# EAGLE design ArduFrauenfelderCNC (EAGLE 5.11)
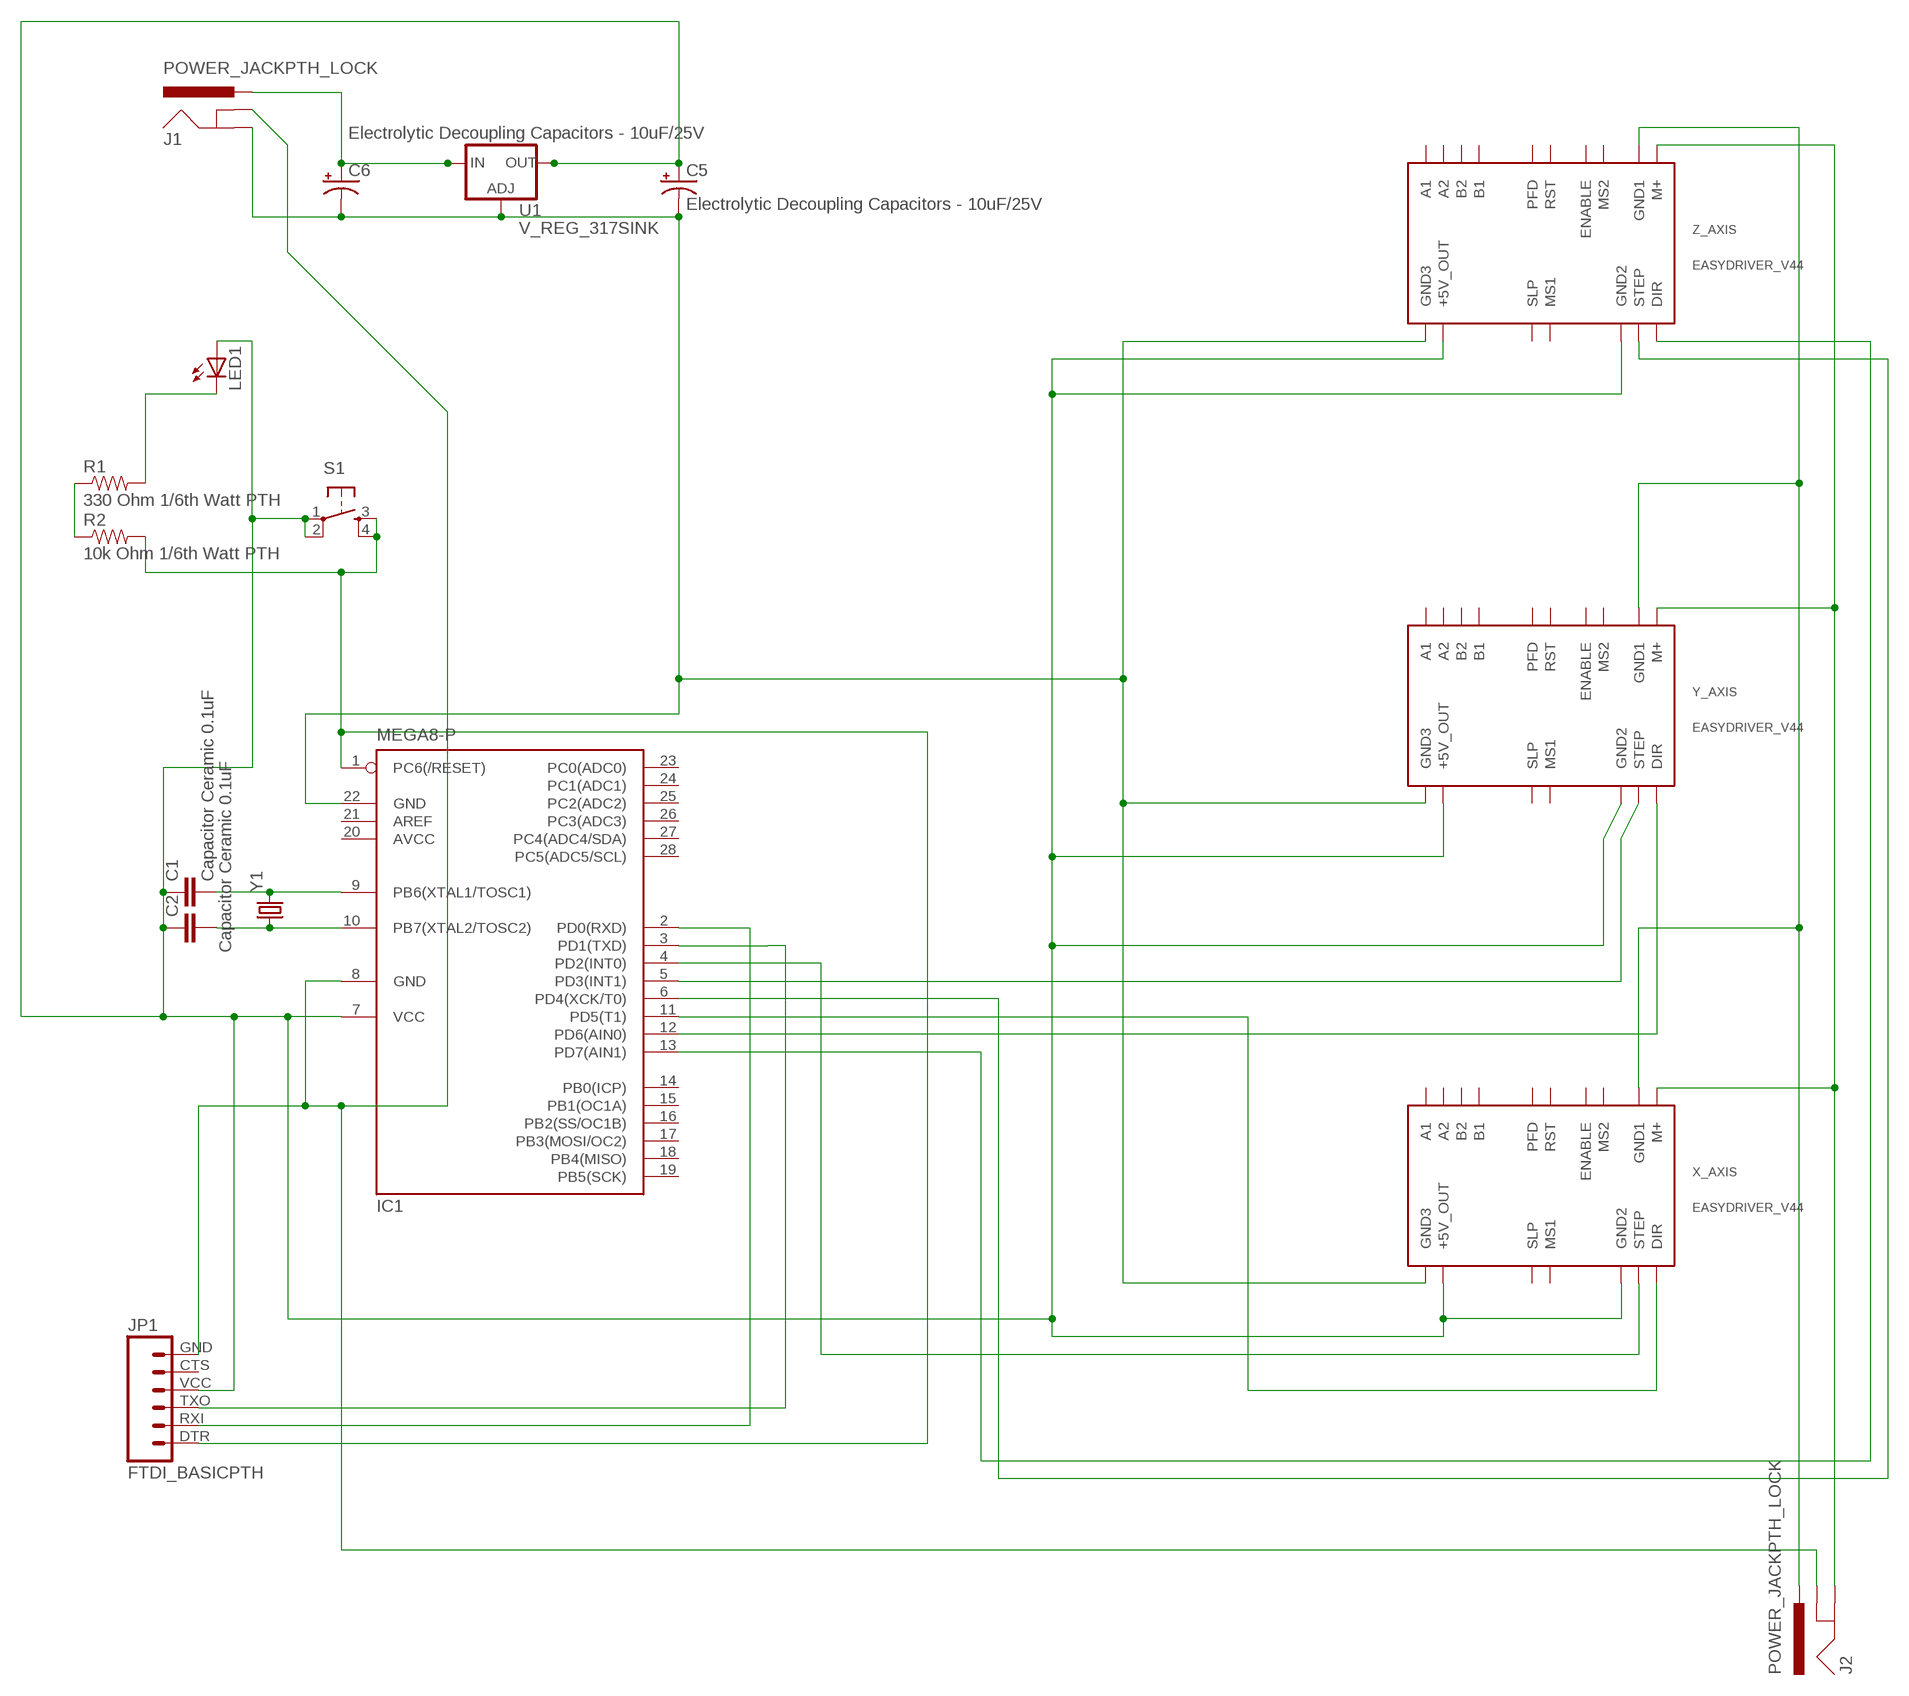
[diagram p0: schematic, sheet 1]

## Parts
C1  Capacitor Ceramic 0.1uF  CAPPTH  [CAP-PTH-SMALL]
C2  Capacitor Ceramic 0.1uF  CAPPTH  [CAP-PTH-SMALL]
C5  Electrolytic Decoupling Capacitors - 10uF/25V  CAP_POLPTH2  [CPOL-RADIAL-10UF-25V]
C6  Electrolytic Decoupling Capacitors - 10uF/25V  CAP_POLPTH2  [CPOL-RADIAL-10UF-25V]
IC1  MEGA8-P  [DIL28-3]
J1  POWER_JACKPTH_LOCK  [POWER_JACK_PTH_LOCK]
J2  POWER_JACKPTH_LOCK  [POWER_JACK_PTH_LOCK]
JP1  FTDI_BASICPTH  [FTDI_BASIC]
LED1  LED5MM  [LED5MM]
R1  330 Ohm 1/6th Watt PTH  RESISTORPTH-1/4W  [AXIAL-0.4]
R2  10k Ohm 1/6th Watt PTH  RESISTORPTH-1/4W  [AXIAL-0.4]
S1  TAC_SWITCHPTH  [TACTILE-PTH]
U1  V_REG_317SINK  [TO220-ADJ]
X_AXIS  EASYDRIVER_V44  [EASYDRIVER_V44]
Y1  CRYSTALHC49US  [HC49US]
Y_AXIS  EASYDRIVER_V44  [EASYDRIVER_V44]
Z_AXIS  EASYDRIVER_V44  [EASYDRIVER_V44]

## Nets
N$1: C1.2 IC1.9(PB6(XTAL1/TOSC1)) Y1.2
N$2: C2.2 IC1.10(PB7(XTAL2/TOSC2)) Y1.1
N$3: IC1.5(PD3(INT1)) Y_AXIS.STEP
N$4: LED1.K(C) R1.P$2
N$5: IC1.1(PC6(/RESET)) JP1.DTR R2.P$2 S1.3 S1.4
N$6: R1.P$1 R2.P$1
N$7: C6.1(+) J1.PWR U1.IN
N$8: C5.2(-) C6.2(-) IC1.22(GND) J1.GND U1.ADJ X_AXIS.GND3 Y_AXIS.GND3 Z_AXIS.GND3
N$9: C1.1 C2.1 C5.1(+) IC1.7(VCC) JP1.VCC LED1.A S1.1 S1.2 U1.OUT X_AXIS.GND2 X_AXIS.P$11(+5V_OUT) Y_AXIS.GND2 Y_AXIS.P$11(+5V_OUT) Z_AXIS.GND2 Z_AXIS.P$11(+5V_OUT)
N$10: IC1.8(GND) J1.GNDBREAK J2.GNDBREAK JP1.GND
N$11: IC1.3(PD1(TXD)) JP1.TXO
N$12: IC1.2(PD0(RXD)) JP1.RXI
N$13: IC1.12(PD6(AIN0)) Y_AXIS.DIR
N$14: IC1.4(PD2(INT0)) X_AXIS.STEP
N$15: J2.PWR X_AXIS.GND1 Y_AXIS.GND1 Z_AXIS.GND1
N$16: IC1.11(PD5(T1)) X_AXIS.DIR
N$18: J2.GND X_AXIS.M+ Y_AXIS.M+ Z_AXIS.M+
N$19: IC1.13(PD7(AIN1)) Z_AXIS.DIR
N$20: IC1.6(PD4(XCK/T0)) Z_AXIS.STEP
Unconnected: IC1.14(PB0(ICP)) IC1.15(PB1(OC1A)) IC1.16(PB2(SS/OC1B)) IC1.17(PB3(MOSI/OC2)) IC1.18(PB4(MISO)) IC1.19(PB5(SCK)) IC1.21(AREF) IC1.23(PC0(ADC0)) IC1.24(PC1(ADC1)) IC1.25(PC2(ADC2)) IC1.26(PC3(ADC3)) IC1.27(PC4(ADC4/SDA)) IC1.28(PC5(ADC5/SCL)) JP1.CTS X_AXIS.A1 X_AXIS.A2 X_AXIS.B1 X_AXIS.B2 X_AXIS.ENABLE X_AXIS.MS1 X_AXIS.MS2 X_AXIS.PFD X_AXIS.RST X_AXIS.SLEEP(SLP) Y_AXIS.A1 Y_AXIS.A2 Y_AXIS.B1 Y_AXIS.B2 Y_AXIS.ENABLE Y_AXIS.MS1 Y_AXIS.MS2 Y_AXIS.PFD Y_AXIS.RST Y_AXIS.SLEEP(SLP) Z_AXIS.A1 Z_AXIS.A2 Z_AXIS.B1 Z_AXIS.B2 Z_AXIS.ENABLE Z_AXIS.MS1 Z_AXIS.MS2 Z_AXIS.PFD Z_AXIS.RST Z_AXIS.SLEEP(SLP)

## Power pins joined to a net without a drawn wire
AVCC: IC1.20(AVCC)

## Library data of the parts
C1 C2 = SparkFun:CAP: Capacitor Standard 0603 ceramic capacitor, and 0.1" leaded capacitor.
C5 C6 = SparkFun:CAP_POL: Capacitor Polarized These are standard SMD and PTH capacitors. Normally 10uF, 47uF, and 100uF in electrolytic and tantalum varieties. Always verify the external diameter of the through hole cap, it varies with capacity, voltage, and manufacturer. The EIA devices should be standard.
IC1 = atmel:MEGA8-P: MICROCONTROLLER 8 Kbytes FLASH, 1 kbytes SRAM, 512 bytes EEPROM, USART, 4-channel 10 bit ADC, 2-channel 8 bit ADC Pin compatible with Atmega48, ATMega88, ATMega168 Source: avr.lbr; OC_FARNELL: unknown; OC_NEWARK: unknown
J1 J2 = SparkFun:POWER_JACK: Power Jack This is the standard 5.5mm barrel jack for power. The PTH is the most common, proven, reliable, footprint. All others are experimental. The Slot footprint only works if the mill layer is transmitted to the PCB fab house so be warned. Spark Fun Electronics SKU : PRT-00119. Mating wall wart : TOL-00298 (and others)
JP1 = SparkFun:FTDI_BASIC: FTDI Basic: 3.3V and 5V
LED1 = SparkFun:LED: LEDs Standard schematic elements and footprints for 5mm, 3mm, 1206, and 0603 sized LEDs. 5mm - Spark Fun Electronics SKU : COM-00529 (and others)
R1 R2 = SparkFun:RESISTOR: Resistor Basic schematic elements and footprints for 0603, 1206, and PTH resistors.
S1 = SparkFun:TAC_SWITCH: Momentary Switch Button commonly used for reset or general input. Spark Fun Electronics SKU : COM-00097
U1 = SparkFun:V_REG_317: Voltage Regulator Standard LM317 adjustable voltage regulator. AOI (Adjust Output Input). Google 'LM317 Calculator' for easy to use app to get the two resistor values needed. 240/720 for 5V output. 240/390 for 3.3V output. Spark Fun Electronics SKU : COM-00527
X_AXIS Y_AXIS Z_AXIS = EasyDriver:EASYDRIVER_V44: EasyDriver version 4.4 - http://www.schmalzhaus.com/EasyDriver
Y1 = SparkFun:CRYSTAL: Crystals Various standard crystals. Proven footprints. Spark Fun Electronics SKU : COM-00534

## Board
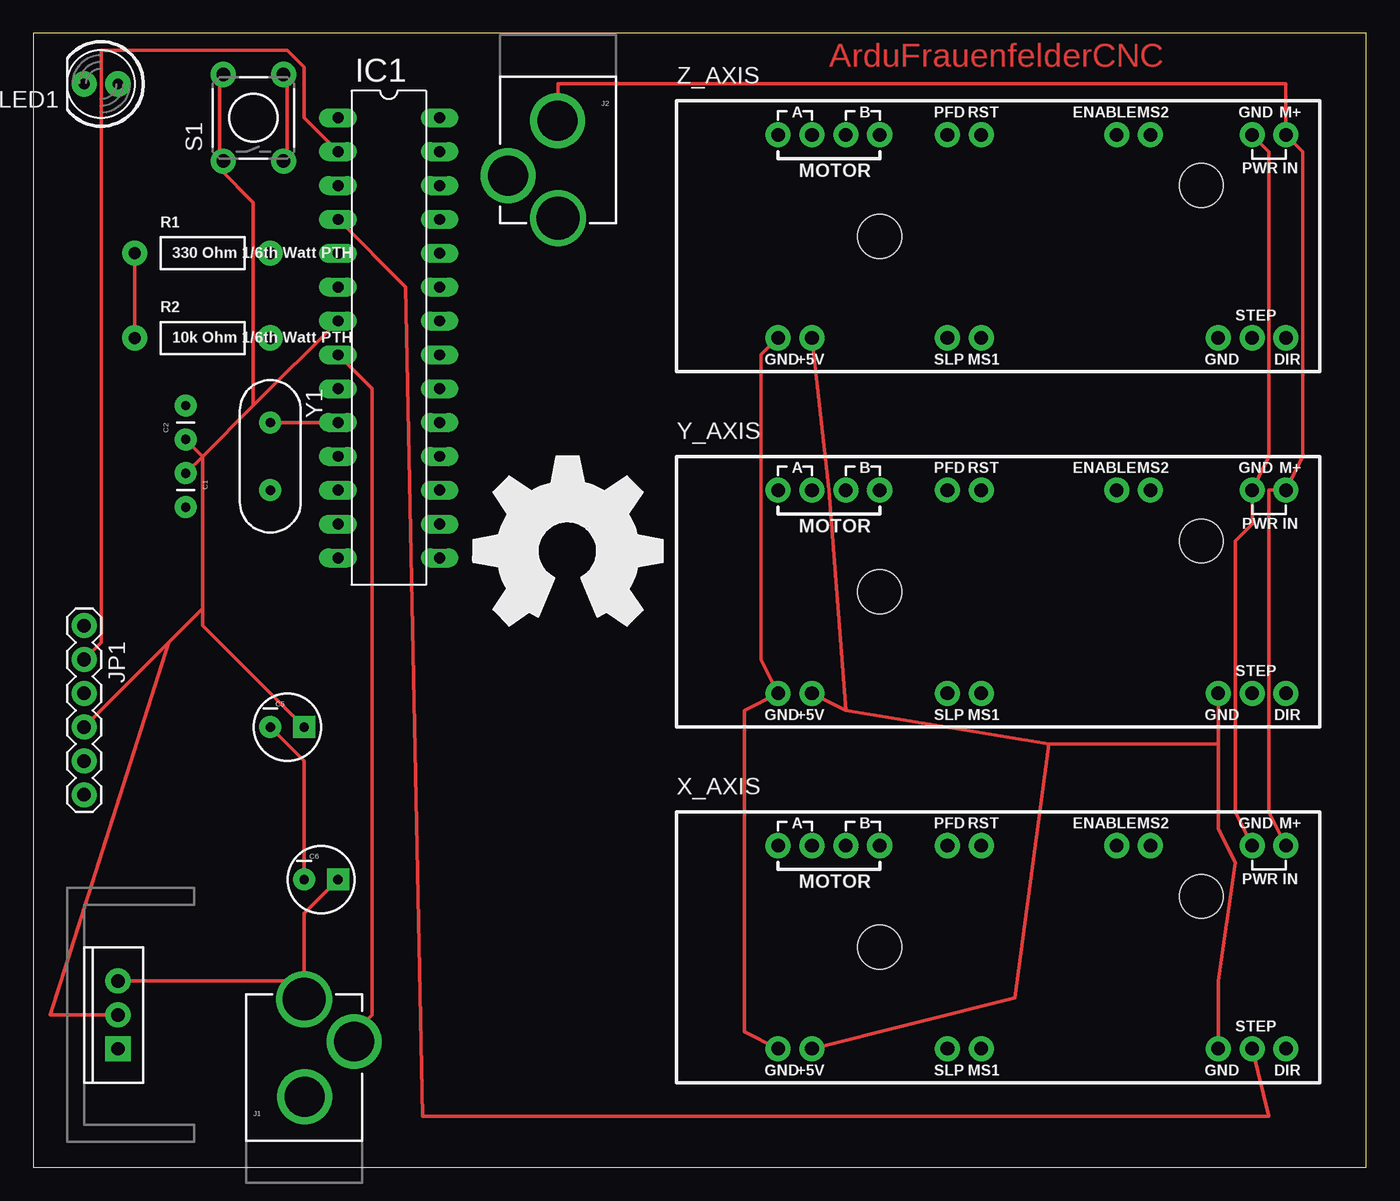
[diagram p1: board, top side]
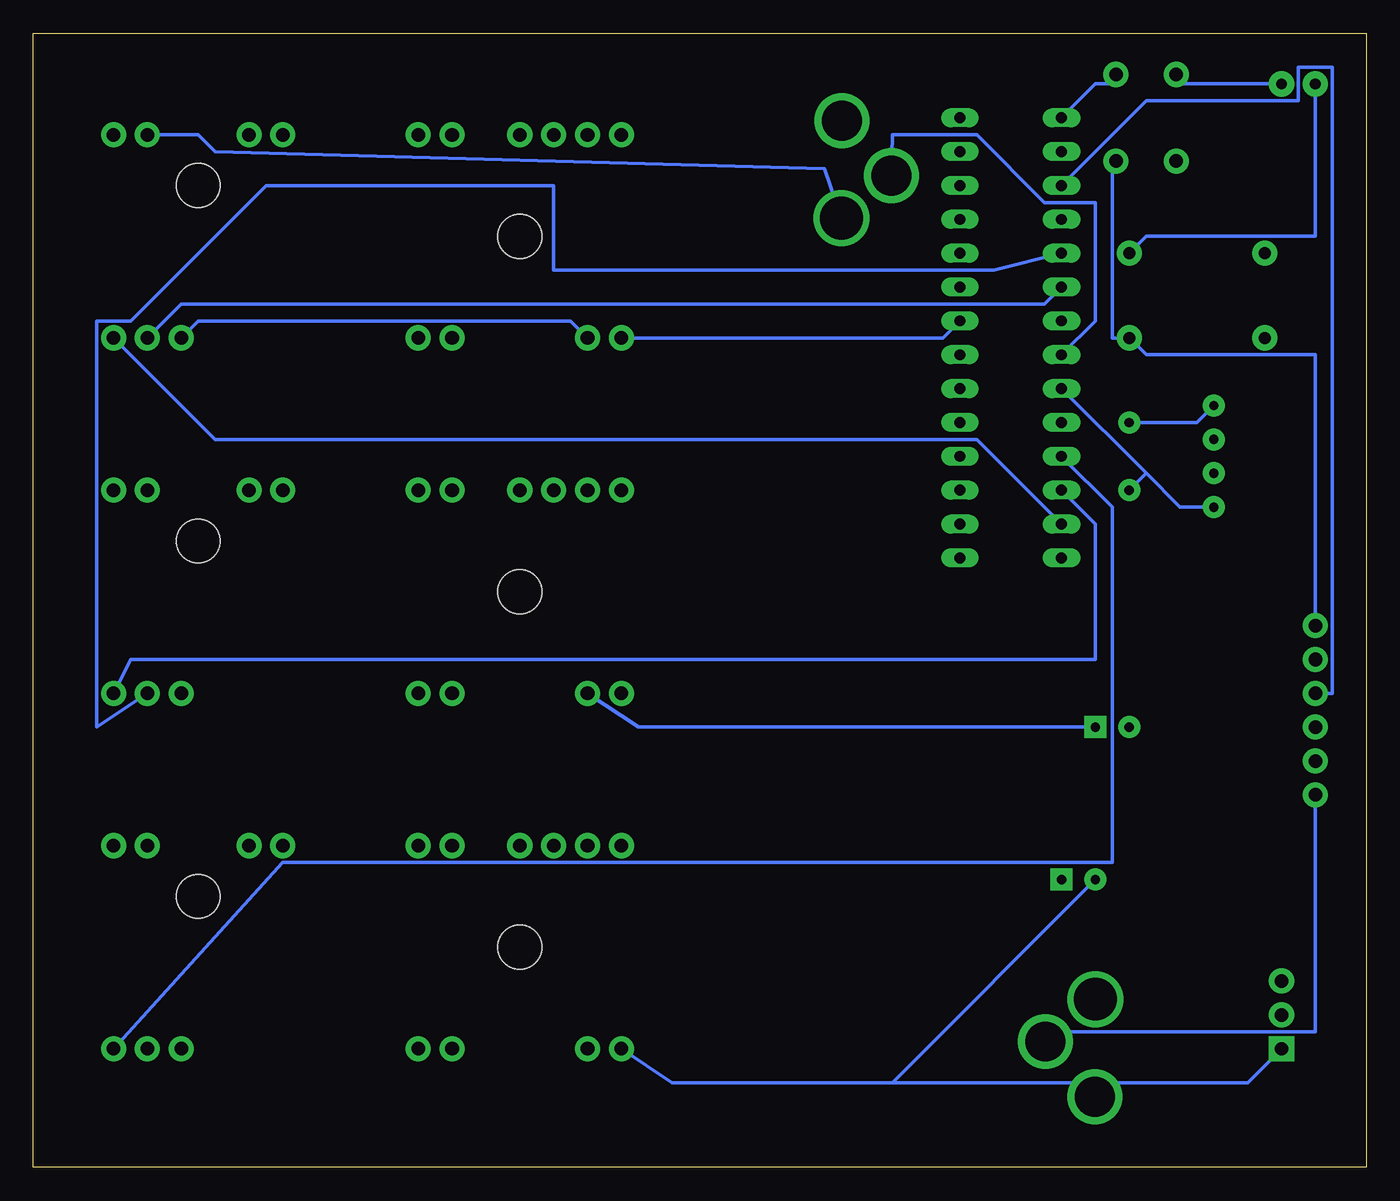
[diagram p2: board, bottom side, seen from below]

Size 100 x 85.08 mm. Coordinates in mm from the lower left corner, seen from the top.
Outline: 0,0 100,0 100,85.08 0,85.08 0,0
Copper layers (1*16): Top 0.035mm / dielectric 1.5mm / Bottom 0.035mm
Design rules "SparkFun": minimum track width 8mil, minimum drill 20mil, track to track 8mil, track to pad 8mil, pad to pad 8mil, via to via 8mil, smd to smd 8mil, copper to edge 10mil, drill to drill 8mil, minimum pad ring 12mil, minimum via ring 10mil, stop-mask expansion 4mil, vias tented up to drill 25mil, thermal gap 10mil

### Footprints (pad centres in the part's own frame; a part is rotated, then mirrored left to right if it is on the bottom)
CAP-PTH-SMALL = drill 0.7 pad 1.651 round: 1 0,0; 2 2.54,0
CPOL-RADIAL-10UF-25V = drill 0.7 pad 1.651 square: 1 1.27,0 | drill 0.7 pad 1.651 round: 2 -1.27,0
DIL28-3 = drill 0.813 long: 1 -16.51,-3.81; 2 -13.97,-3.81; 3 -11.43,-3.81; 4 -8.89,-3.81; 5 -6.35,-3.81; 6 -3.81,-3.81; 7 -1.27,-3.81; 8 1.27,-3.81; 9 3.81,-3.81; 10 6.35,-3.81; 11 8.89,-3.81; 12 11.43,-3.81; 13 13.97,-3.81; 14 16.51,-3.81; 15 16.51,3.81; 16 13.97,3.81; 17 11.43,3.81; 18 8.89,3.81; 19 6.35,3.81; 20 3.81,3.81; 21 1.27,3.81; 22 -1.27,3.81; 23 -3.81,3.81; 24 -6.35,3.81; 25 -8.89,3.81; 26 -11.43,3.81; 27 -13.97,3.81; 28 -16.51,3.81
POWER_JACK_PTH_LOCK = drill 2.997 pad 4.115 round: GND 0.025,6.557; GNDBREAK 3.762,10.7 | drill 3.2 pad 4.115 round: PWR 0,13.878
FTDI_BASIC = drill 1.016 pad 1.88 round: CTS 10.16,0; DTR 0,0; GND 12.7,0; RXI 2.54,0; TXO 5.08,0; VCC 7.62,0
LED5MM = drill 0.813 pad 1.88 round: A -1.27,0; K 1.27,0
AXIAL-0.4 = drill 0.9 pad 1.88 round: P$1 -5.08,0; P$2 5.08,0
TACTILE-PTH = drill 1.016 pad 1.88 round: 1 -3.251,2.261; 2 3.251,2.261; 3 -3.251,-2.261; 4 3.251,-2.261
TO220-ADJ = drill 1 pad 1.88 square: ADJ -2.54,0 | drill 1 pad 1.88 round: IN 2.54,0; OUT 0,0
EASYDRIVER_V44 = drill 1.016 pad 1.88 round: A1 -16.51,7.62; A2 -13.97,7.62; B1 -8.89,7.62; B2 -11.43,7.62; DIR 21.59,-7.62; ENABLE 8.89,7.62; GND1 19.05,7.62; GND2 16.51,-7.62; GND3 -16.51,-7.62; M+ 21.59,7.62; MS1 -1.27,-7.62; MS2 11.43,7.62; P$11 -13.97,-7.62; PFD -3.81,7.62; RST -1.27,7.62; SLEEP -3.81,-7.62; STEP 19.05,-7.62 | hole 3.302: 15.24,3.81; -8.89,0
HC49US = drill 0.7 pad 1.651 round: 1 -2.54,0; 2 2.54,0

### Placement (x,y rotation side)
C1  11.43,52.07 270 top
C2  11.43,54.61 90 top
C5  19.05,33.02 0 top
C6  21.59,21.59 0 top
IC1  26.67,62.23 270 top
J1  20.32,-1.27 0 top
J2  39.37,85.09 180 top
JP1  3.81,40.64 270 top
LED1  5.08,81.28 180 top
R1  12.7,68.58 0 top
R2  12.7,62.23 0 top
S1  16.51,78.74 90 top
U1  6.35,11.43 90 top
U$1  [OSHW_FILLX500_NOTEXT]  33.02,40.64 0 top
X_AXIS  72.39,16.51 0 top
Y1  17.78,53.34 270 top
Y_AXIS  72.39,43.18 0 top
Z_AXIS  72.39,69.85 0 top

### Tracks (layer width: path | path; a pad name or v marks a point on that pad's centre or on a via)
N$1
  Bottom 0.254: 16.51,52.07 13.97,49.53 C1.2 | 16.51,52.07 IC1.9 | 16.51,52.07 Y1.2
N$2
  Top 0.254: Y1.1 IC1.10
  Bottom 0.254: C2.2 12.7,55.88 Y1.1
N$3
  Bottom 0.254: IC1.5 27.94,67.31 60.96,67.31 60.96,73.66 82.55,73.66 92.71,63.5 95.25,63.5 95.25,33.02 Y_AXIS.STEP
N$4
  Bottom 0.254: LED1.K 3.81,69.85 16.51,69.85 R1.P$2
N$5
  Top 0.254: S1.3 19.05,76.2 19.05,81.28 S1.4
  Bottom 0.254: IC1.1 20.32,81.28 19.05,81.28 S1.4 | JP1.DTR 3.81,60.96 16.51,60.96 R2.P$2 19.05,62.23 19.05,74.93 S1.3
N$6
  Top 0.254: R2.P$1 R1.P$1
N$7
  Top 0.254: C6.1 20.32,19.05 20.32,13.97 | 20.32,13.97 J1.PWR 20.32,12.7 | U1.IN 20.32,13.97
N$8
  Top 0.254: Z_AXIS.GND3 54.61,60.96 54.61,38.1 Y_AXIS.GND3 53.34,34.29 53.34,10.16 X_AXIS.GND3 | C5.2 20.32,30.48 C6.2
  Bottom 0.254: IC1.22 31.75,62.23 Z_AXIS.GND3 | U1.ADJ 8.89,6.35 20.32,6.35 J1.GND 21.59,6.35 35.56,6.35 | X_AXIS.GND3 52.07,6.35 35.56,6.35 | 35.56,6.35 C6.2
N$9
  Top 0.254: X_AXIS.GND2 88.9,13.97 90.17,22.86 88.9,25.4 88.9,31.75 | 88.9,31.75 Y_AXIS.GND2 | X_AXIS.P$11 73.66,12.7 76.2,31.75 | 60.96,34.29 76.2,31.75 | Y_AXIS.P$11 60.96,34.29 | Z_AXIS.P$11 59.69,50.8 60.96,34.29 | 76.2,31.75 88.9,31.75 | S1.2 13.97,81.28 13.97,76.2 S1.1 13.97,74.93 16.51,72.39 16.51,57.15 | 12.7,53.34 C1.1 | 12.7,53.34 16.51,57.15 | 16.51,57.15 IC1.7 | 12.7,53.34 C2.1 | C5.1 12.7,40.64 12.7,41.91 | 12.7,41.91 12.7,53.34 | 10.16,39.37 12.7,41.91 | 10.16,39.37 JP1.VCC | U1.OUT 1.27,11.43 10.16,39.37
  Bottom 0.254: Z_AXIS.GND2 87.63,63.5 59.69,63.5 Z_AXIS.P$11 | LED1.A 13.97,81.28 S1.2 | Y_AXIS.P$11 54.61,33.02 C5.1
N$10
  Top 0.254: IC1.8 25.4,58.42 25.4,11.43 24.13,10.16 J1.GNDBREAK
  Bottom 0.254: IC1.8 20.32,63.5 20.32,72.39 24.13,72.39 29.21,77.47 35.56,77.47 J2.GNDBREAK | JP1.GND 3.81,10.16 22.86,10.16 J1.GNDBREAK
N$11
  Bottom 0.254: IC1.3 16.51,80.01 5.08,80.01 5.08,82.55 2.54,82.55 2.54,35.56 JP1.TXO
N$12
  Top 0.254: IC1.2 20.32,78.74 20.32,82.55 19.05,83.82 5.08,83.82 5.08,39.37 JP1.RXI
N$13
  Bottom 0.254: IC1.12 20.32,48.26 20.32,38.1 92.71,38.1 Y_AXIS.DIR
N$14
  Top 0.254: IC1.4 27.94,66.04 29.21,3.81 92.71,3.81 X_AXIS.STEP
N$15
  Top 0.254: X_AXIS.GND1 90.17,26.67 90.17,46.99 91.44,48.26 Y_AXIS.GND1 92.71,53.34 92.71,76.2 Z_AXIS.GND1
  Bottom 0.254: Z_AXIS.GND1 87.63,77.47 86.36,76.2 40.64,74.93 J2.PWR
N$16
  Bottom 0.254: IC1.11 19.05,49.53 19.05,22.86 81.28,22.86 X_AXIS.DIR
N$18
  Top 0.254: X_AXIS.M+ 92.71,26.67 92.71,50.8 Y_AXIS.M+ 95.25,53.34 95.25,76.2 Z_AXIS.M+ 93.98,81.28 39.37,81.28 J2.GND
N$19
  Bottom 0.254: IC1.13 29.21,54.61 86.36,54.61 Z_AXIS.DIR
N$20
  Bottom 0.254: IC1.6 24.13,64.77 88.9,64.77 Z_AXIS.STEP

### Text on the board
Top: ArduFrauenfelderCNC